# EAGLE schematic GameBit_Board (EAGLE 9.0.1)

## Sheet 1 of 3
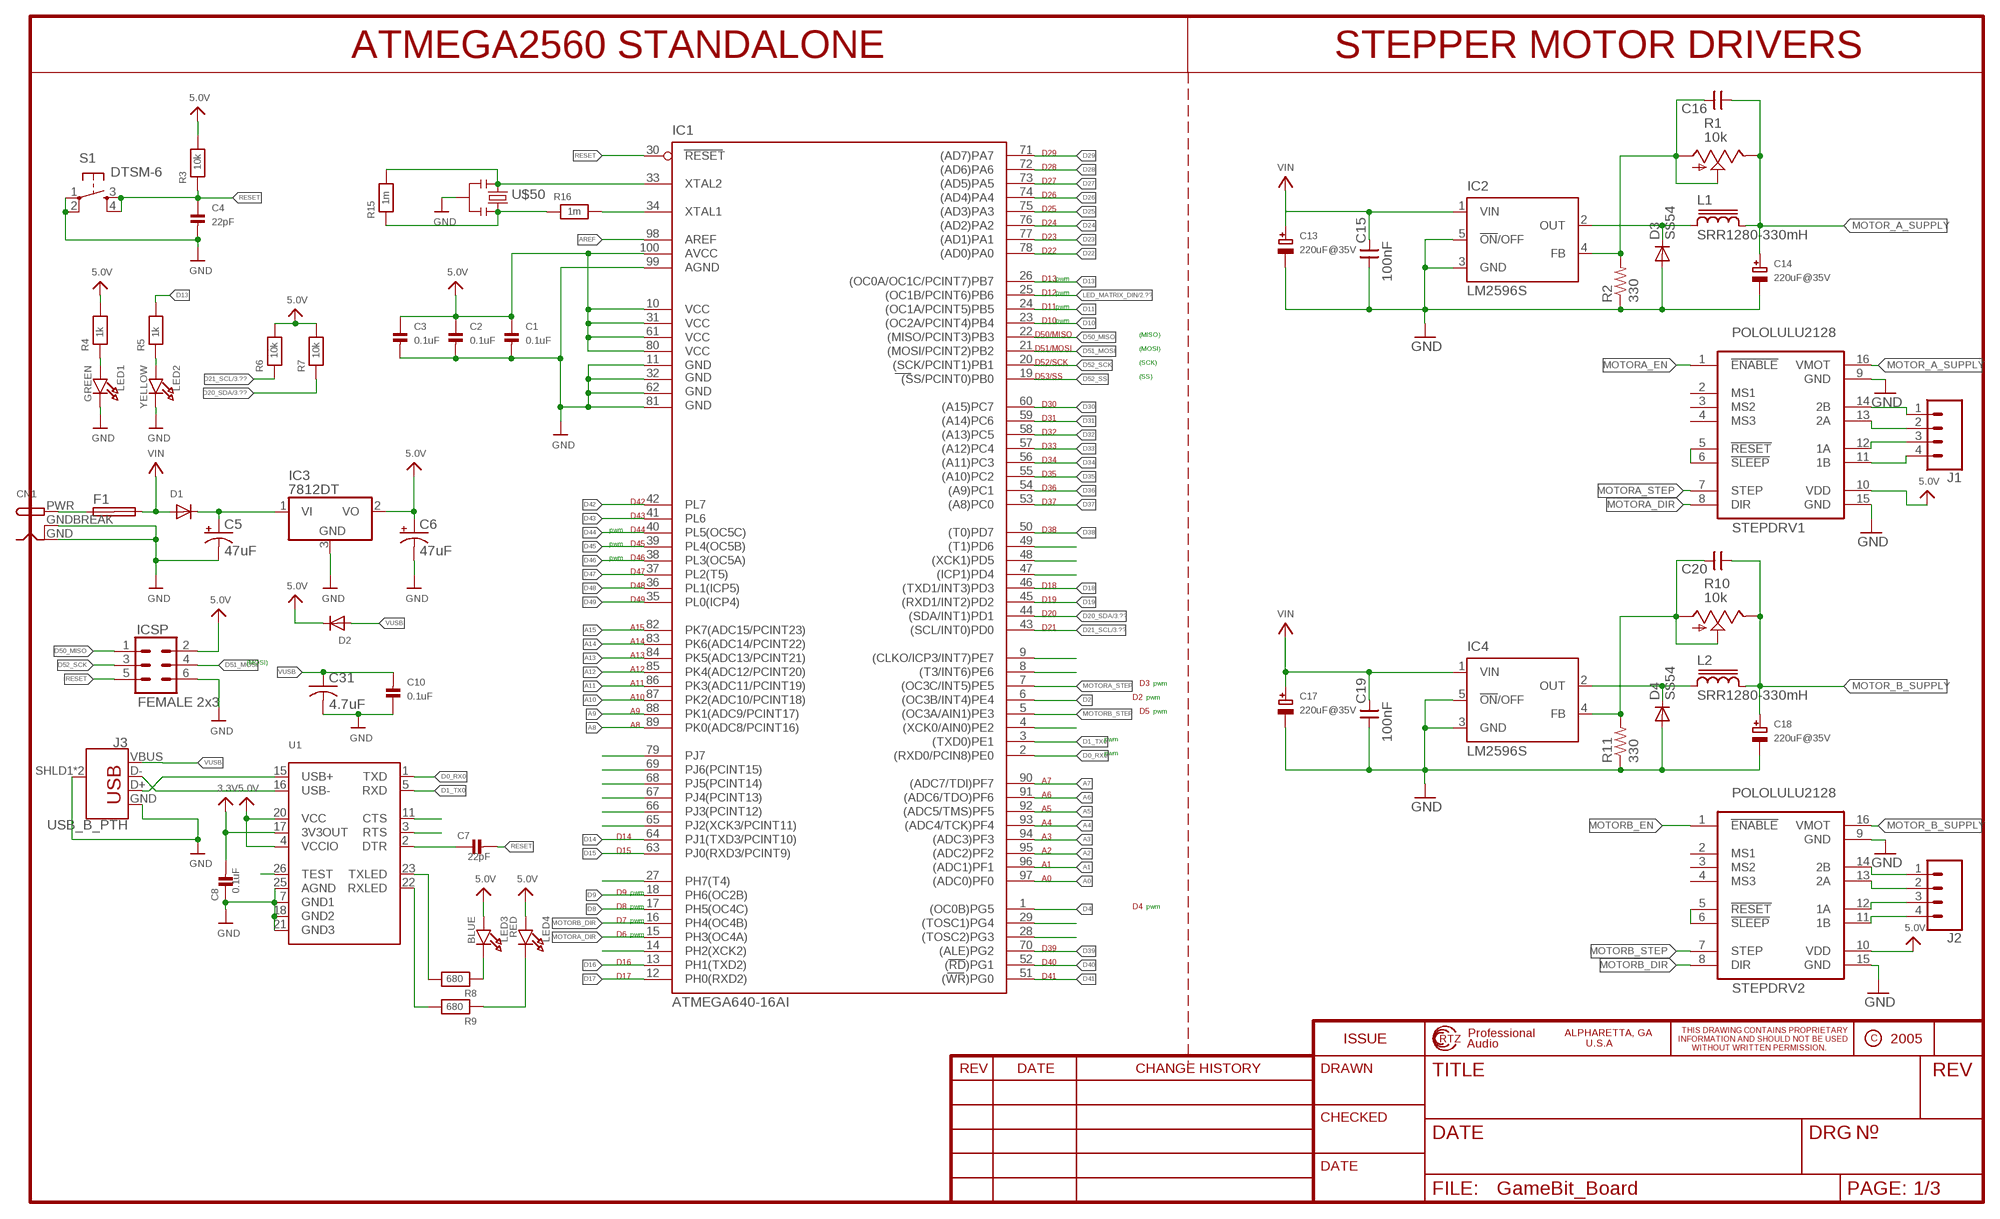
[diagram p0: schematic, sheet 1]

### Parts
C1  0.1uF  CAP_CERAMIC0603  [0603]
C2  0.1uF  CAP_CERAMIC0603  [0603]
C3  0.1uF  CAP_CERAMIC0603  [0603]
C4  22pF  CAP_CERAMIC0603  [0603]
C5  47uF  CPOL-USD  [PANASONIC_D]
C6  47uF  CPOL-USD  [PANASONIC_D]
C7  22pF  CAP_CERAMIC0603  [0603]
C8  0.1uF  CAP_CERAMIC0603  [0603]
C10  0.1uF  CAP_CERAMIC0603  [0603]
C13  220uF@35V  CAP_ELECTROLYTICPANASONIC_D  [PANASONIC_D]
C14  220uF@35V  CAP_ELECTROLYTICPANASONIC_D  [PANASONIC_D]
C15  100nF  CNP-0603  [0603]
C16  CNP-0603  [0603]
C17  220uF@35V  CAP_ELECTROLYTICPANASONIC_D  [PANASONIC_D]
C18  220uF@35V  CAP_ELECTROLYTICPANASONIC_D  [PANASONIC_D]
C19  100nF  CNP-0603  [0603]
C20  CNP-0603  [0603]
C31  4.7uF  C-USC0805  [C0805]
CN1  DCBARRELPTH  [DCJACK_2MM_PTH]
D1  DIODESOD-123  [SOD-123]
D2  DIODESOD-123  [SOD-123]
D3  SS54  S3G  [DO214AB]
D4  SS54  S3G  [DO214AB]
F1  SHK20L  [SHK20L]
IC1  ATMEGA640-16AI  [TQFP100]
IC2  LM2596S  [TO263-5]
IC3  7812DT  [TO252]
IC4  LM2596S  [TO263-5]
ICSP  FEMALE 2x3  CONN_03X2FEMALE  [2X3]
J1  CONN_04JST-PTH-VERT  [JST-4-PTH-VERT]
J2  CONN_04JST-PTH-VERT  [JST-4-PTH-VERT]
J3  USB_B_PTH  [USB-B-PTH]
L1  SRR1280-330mH  SRR1280  [SRR1280]
L2  SRR1280-330mH  SRR1280  [SRR1280]
LED1  GREEN  LED0603  [CHIPLED_0603]
LED2  YELLOW  LED0603  [CHIPLED_0603]
LED3  BLUE  LED0603  [CHIPLED_0603]
LED4  RED  LED0603  [CHIPLED_0603]
R1  10k  TRIM_US-S64W  [S64W]
R2  330  R-US_R0603  [R0603]
R3  10k  RESISTOR0603  [0603]
R4  1k  RESISTOR0603  [0603]
R5  1k  RESISTOR0603  [0603]
R6  10k  RESISTOR0603  [0603]
R7  10k  RESISTOR0603  [0603]
R8  680  RESISTOR0603  [0603]
R9  680  RESISTOR0603  [0603]
R10  10k  TRIM_US-S64W  [S64W]
R11  330  R-US_R0603  [R0603]
R15  1m  RESISTOR0805  [0805]
R16  1m  RESISTOR0805  [0805]
S1  DTSM-6  [DTSM-6]
STEPDRV1  POLOLULU2128  [POLOLULU2128]
STEPDRV2  POLOLULU2128  [POLOLULU2128]
U1  FT232RLSSOP28  [SSOP28DB]
U$50  RESONATORSMD  [RESONATOR-SMD]

### Nets
3.3V: C8.2 U1.17(3V3OUT)
5.0V: C1.1 C2.1 C3.1 C6.+ D2.C IC1.10(VCC) IC1.31(VCC1) IC1.61(VCC2) IC1.80(VCC3) IC1.100(AVCC) IC3.2(VO) ICSP.2 LED3.A LED4.A R3.2 R4.2 R6.2 R7.2 STEPDRV1.10(VDD) STEPDRV2.10(VDD) U1.4(VCCIO) U1.20(VCC) ; also sheet 3
A0: IC1.97((ADC0)PF0)
A1: IC1.96((ADC1)PF1)
A2: IC1.95((ADC2)PF2)
A3: IC1.94((ADC3)PF3)
A4: IC1.93((ADC4/TCK)PF4)
A5: IC1.92((ADC5/TMS)PF5)
A6: IC1.91((ADC6/TDO)PF6)
A7: IC1.90((ADC7/TDI)PF7)
A8: IC1.89(PK0(ADC8/PCINT16))
A9: IC1.88(PK1(ADC9/PCINT17))
A10: IC1.87(PK2(ADC10/PCINT18))
A11: IC1.86(PK3(ADC11/PCINT19))
A12: IC1.85(PK4(ADC12/PCINT20))
A13: IC1.84(PK5(ADC13/PCINT21))
A14: IC1.83(PK6(ADC14/PCINT22))
A15: IC1.82(PK7(ADC15/PCINT23))
AREF: IC1.98(AREF)
D0_RX0: IC1.2((RXD0/PCIN8)PE0) U1.1(TXD)
D1_TX0: IC1.3((TXD0)PE1) U1.5(RXD)
D2: IC1.6((OC3B/INT4)PE4)
D4: IC1.1((OC0B)PG5)
D8: IC1.17(PH5(OC4C))
D9: IC1.18(PH6(OC2B))
D10: IC1.23((OC2A/PCINT4)PB4)
D11: IC1.24((OC1A/PCINT5)PB5)
D13: IC1.26((OC0A/OC1C/PCINT7)PB7) R5.2
D14: IC1.64(PJ1(TXD3/PCINT10))
D15: IC1.63(PJ0(RXD3/PCINT9))
D16: IC1.13(PH1(TXD2))
D17: IC1.12(PH0(RXD2))
D18: IC1.46((TXD1/INT3)PD3)
D19: IC1.45((RXD1/INT2)PD2)
D20_SDA: IC1.44((SDA/INT1)PD1) R7.1 ; also sheet 3
D21_SCL: IC1.43((SCL/INT0)PD0) R6.1 ; also sheet 3
D22: IC1.78((AD0)PA0)
D23: IC1.77((AD1)PA1)
D24: IC1.76((AD2)PA2)
D25: IC1.75((AD3)PA3)
D26: IC1.74((AD4)PA4)
D27: IC1.73((AD5)PA5)
D28: IC1.72((AD6)PA6)
D29: IC1.71((AD7)PA7)
D30: IC1.60((A15)PC7)
D31: IC1.59((A14)PC6)
D32: IC1.58((A13)PC5)
D33: IC1.57((A12)PC4)
D34: IC1.56((A11)PC3)
D35: IC1.55((A10)PC2)
D36: IC1.54((A9)PC1)
D37: IC1.53((A8)PC0)
D38: IC1.50((T0)PD7)
D39: IC1.70((ALE)PG2)
D40: IC1.52((RD)PG1)
D41: IC1.51((WR)PG0)
D42: IC1.42(PL7)
D43: IC1.41(PL6)
D44: IC1.40(PL5(OC5C))
D45: IC1.39(PL4(OC5B))
D46: IC1.38(PL3(OC5A))
D47: IC1.37(PL2(T5))
D48: IC1.36(PL1(ICP5))
D49: IC1.35(PL0(ICP4))
D50_MISO: IC1.22((MISO/PCINT3)PB3) ICSP.1
D51_MOSI: IC1.21((MOSI/PCINT2)PB2) ICSP.4
D52_SCK: IC1.20((SCK/PCINT1)PB1) ICSP.3
D52_SS: IC1.19((SS/PCINT0)PB0)
GND: C1.2 C2.2 C3.2 C4.2 C5.- C6.- C8.1 C10.1 C13.- C14.- C15.1 C17.- C18.- C19.1 C31.2 CN1.GND CN1.GNDBREAK D3.A D4.A IC1.11(GND) IC1.32(GND1) IC1.62(GND2) IC1.81(GND3) IC1.99(AGND) IC2.3(GND) IC2.5(!ON!/OFF) IC3.3(GND) IC4.3(GND) IC4.5(!ON!/OFF) ICSP.6 J3.GND J3.SHLD1(SHIELD) J3.SHLD2(SHIELD) LED1.C LED2.C R2.1 R11.1 S1.1 S1.2 STEPDRV1.9(GND) STEPDRV1.15(GND) STEPDRV2.9(GND) STEPDRV2.15(GND) U1.7(GND1) U1.18(GND2) U1.21(GND3) U1.25(AGND) U$50.2 ; also sheet 2,3
LED_MATRIX_DIN: IC1.25((OC1B/PCINT6)PB6) ; also sheet 2
MOTOR_A_SUPPLY: C14.+ C16.1 L1.2 R1.E STEPDRV1.16(VMOT)
MOTOR_B_SUPPLY: C18.+ C20.1 L2.2 R10.E STEPDRV2.16(VMOT)
MOTORA_DIR: IC1.15(PH3(OC4A)) STEPDRV1.8(DIR)
MOTORA_EN: STEPDRV1.1(!ENABLE)
MOTORA_STEP: IC1.7((OC3C/INT5)PE5) STEPDRV1.7(STEP)
MOTORB_DIR: IC1.16(PH4(OC4B)) STEPDRV2.8(DIR)
MOTORB_EN: STEPDRV2.1(!ENABLE)
MOTORB_STEP: IC1.5((OC3A/AIN1)PE3) STEPDRV2.7(STEP)
N$1: IC1.65(PJ2(XCK3/PCINT11))
N$2: IC1.66(PJ3(PCINT12))
N$3: D3.C IC2.2(OUT) L1.1
N$4: IC1.67(PJ4(PCINT13))
N$5: IC1.68(PJ5(PCINT14))
N$6: IC1.69(PJ6(PCINT15))
N$7: IC1.79(PJ7)
N$8: IC1.27(PH7(T4))
N$9: IC1.9((CLKO/ICP3/INT7)PE7)
N$10: IC1.49((T1)PD6)
N$11: IC1.48((XCK1)PD5)
N$12: IC1.47((ICP1)PD4)
N$13: IC1.14(PH2(XCK2))
N$14: IC1.8((T3/INT6)PE6)
N$15: CN1.PWR F1.1A
N$16: J3.D+ U1.15(USB+)
N$17: J3.D- U1.16(USB-)
N$18: IC1.4((XCK0/AIN0)PE2)
N$19: LED1.A R4.1
N$20: LED2.A R5.1
N$21: LED3.C R8.1
N$22: R9.2 U1.22(RXLED)
N$23: R8.2 U1.23(TXLED)
N$24: LED4.C R9.1
N$25: IC1.29((TOSC1)PG4)
N$26: IC1.28((TOSC2)PG3)
N$27: C16.2 IC2.4(FB) R1.A R1.S R2.2
N$28: U1.26(TEST)
N$29: U1.11(CTS)
N$30: U1.3(RTS)
N$31: C7.1 U1.2(DTR)
N$32: D4.C IC4.2(OUT) L2.1
N$33: C20.2 IC4.4(FB) R10.A R10.S R11.2
N$34: J1.1 STEPDRV1.14(2B)
N$35: J1.2 STEPDRV1.13(2A)
N$36: J1.3 STEPDRV1.12(1A)
N$37: J1.4 STEPDRV1.11(1B)
N$38: J2.1 STEPDRV2.14(2B)
N$39: J2.2 STEPDRV2.13(2A)
N$40: J2.3 STEPDRV2.12(1A)
N$41: J2.4 STEPDRV2.11(1B)
N$42: STEPDRV1.5(!RESET) STEPDRV1.6(!SLEEP)
N$44: STEPDRV2.5(!RESET) STEPDRV2.6(!SLEEP)
N$77: R15.1 R16.1 U$50.3
N$85: IC1.34(XTAL1) R16.2
N$93: C5.+ D1.C IC3.1(VI)
RESET: C4.1 C7.2 IC1.30(RESET) ICSP.5 R3.1 S1.3 S1.4
VIN: C13.+ C15.2 C17.+ C19.2 D1.A F1.2A IC2.1(VIN) IC4.1(VIN) ; also sheet 2
VUSB: C10.2 C31.1 D2.A J3.VBUS
XTAL2: IC1.33(XTAL2) R15.2 U$50.1
Unconnected: F1.1B F1.2B STEPDRV1.2(MS1) STEPDRV1.3(MS2) STEPDRV1.4(MS3) STEPDRV2.2(MS1) STEPDRV2.3(MS2) STEPDRV2.4(MS3)

### Notes on the sheet
- ATMEGA2560 STANDALONE | STEPPER MOTOR DRIVERS
- D29
- D28
- D27
- D26
- D25
- D24
- D23
- D22
- D13 | pwm
- D12 | pwm
- D11 | pwm
- D10 | pwm
- D50/MISO | (MISO)
- D51/MOSI | (MOSI)
- D52/SCK | (SCK)
- D53/SS | (SS)
- D30
- D31
- D32
- D33
- D34
- D35
- D36
- D42 | D37
- D43
- pwm | D44 | D38
- pwm | D45
- pwm | D46
- D47
- D48 | D18
- D49 | D19
- D20
- A15 | D21
- A14
- A13
- (MOSI)
- A12
- A11 | D3 | pwm
- A10 | D2 | pwm
- A9 | D5 | pwm
- A8
- pwm
- pwm
- A7
- A6
- A5
- A4
- D14 | A3
- D15 | A2
- A1
- A0
- D9 | pwm
- D8 | pwm | D4 | pwm
- D7 | pwm
- D6 | pwm
- D39
- D16 | D40
- D17 | D41

## Sheet 2 of 3
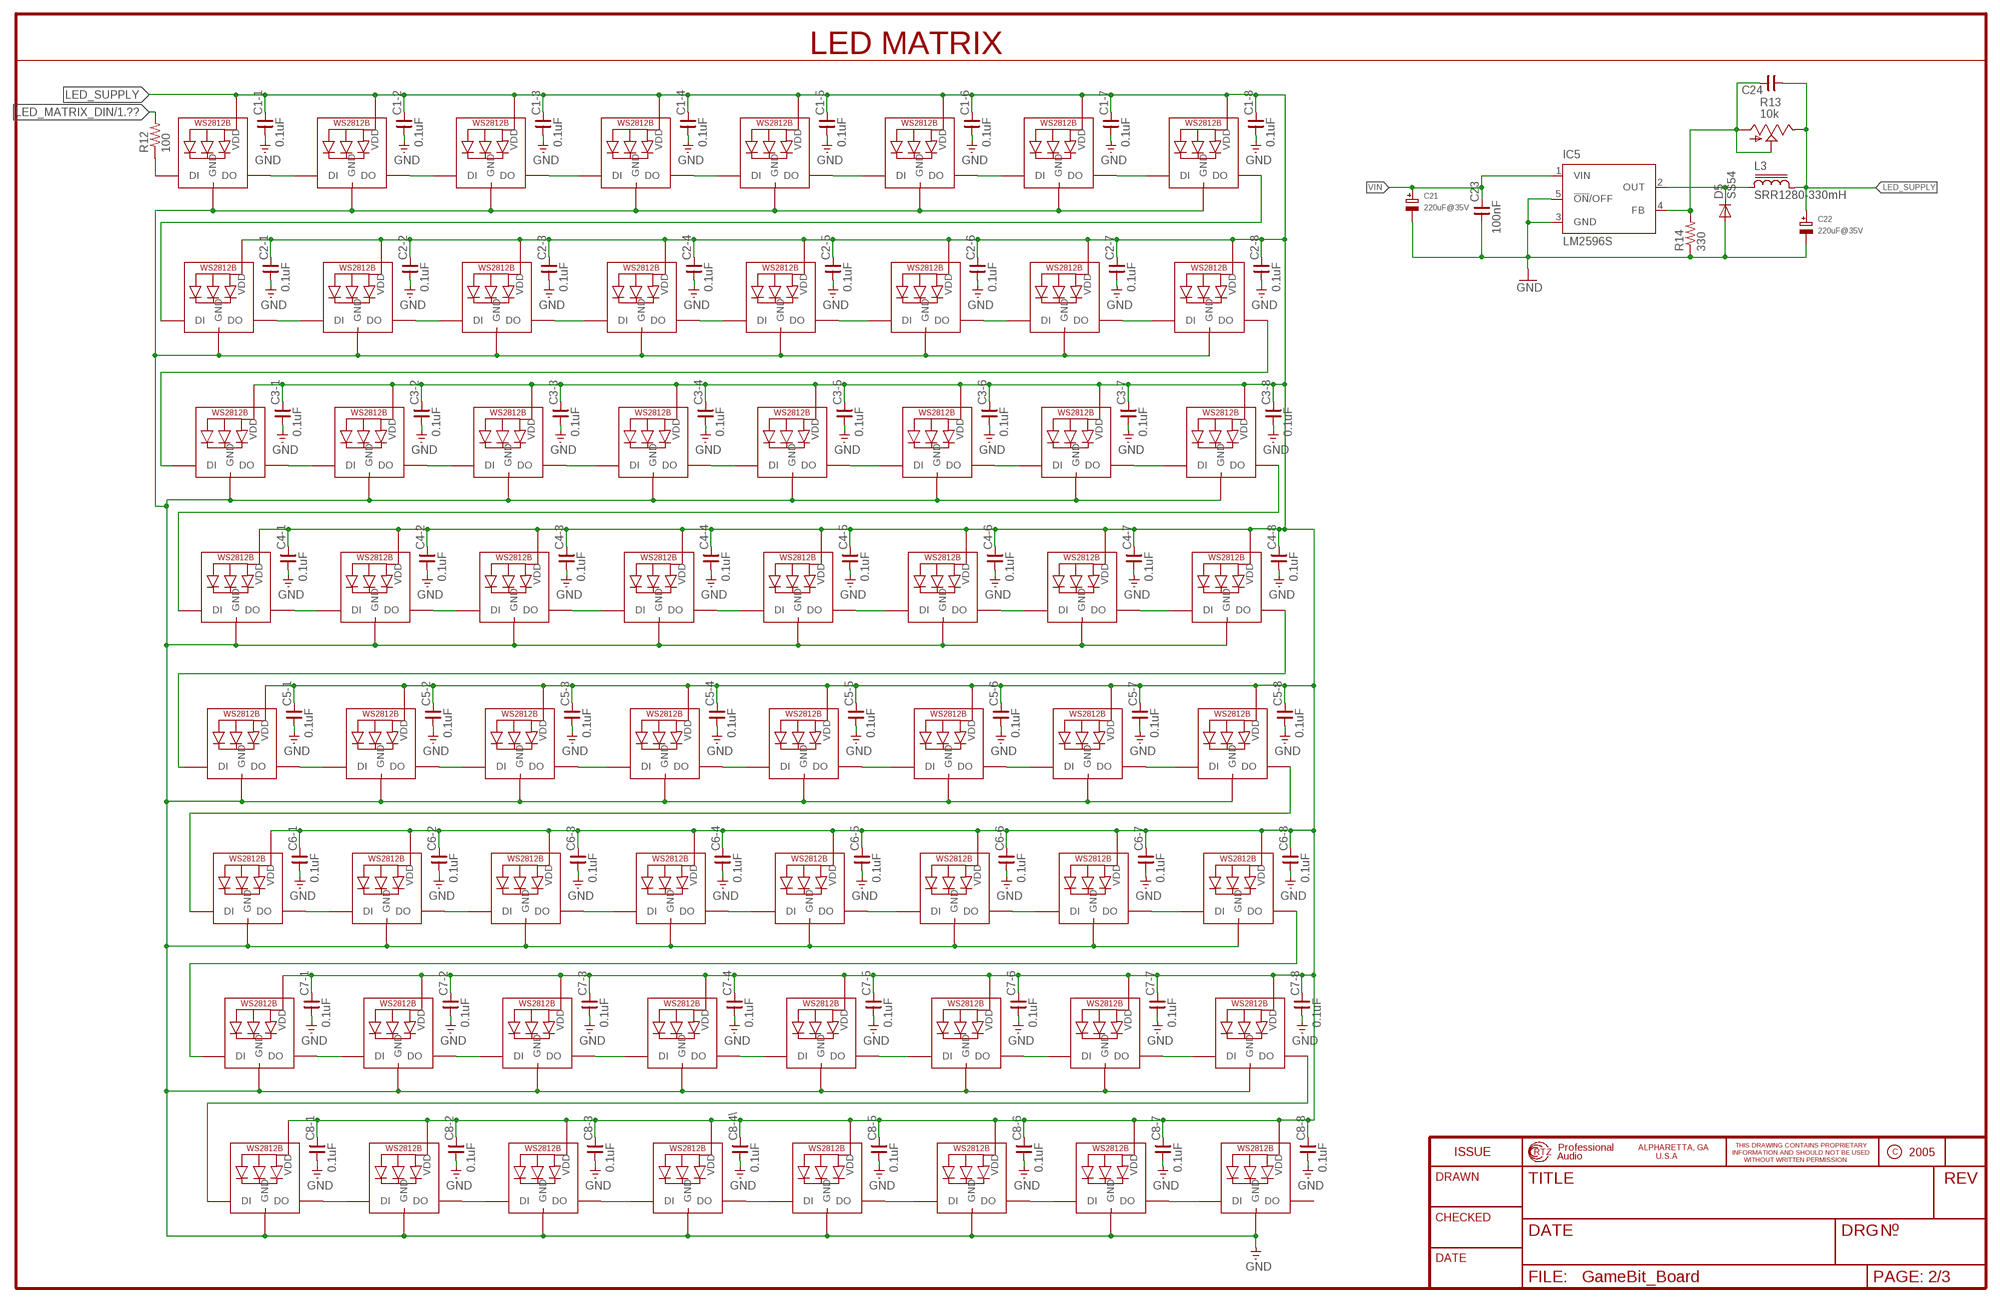
[diagram p1: schematic, sheet 2]

### Parts
C1-1  0.1uF  CNP-0805  [0805]
C1-2  0.1uF  CNP-0805  [0805]
C1-3  0.1uF  CNP-0805  [0805]
C1-4  0.1uF  CNP-0805  [0805]
C1-5  0.1uF  CNP-0805  [0805]
C1-6  0.1uF  CNP-0805  [0805]
C1-7  0.1uF  CNP-0805  [0805]
C1-8  0.1uF  CNP-0805  [0805]
C2-1  0.1uF  CNP-0805  [0805]
C2-2  0.1uF  CNP-0805  [0805]
C2-3  0.1uF  CNP-0805  [0805]
C2-4  0.1uF  CNP-0805  [0805]
C2-5  0.1uF  CNP-0805  [0805]
C2-6  0.1uF  CNP-0805  [0805]
C2-7  0.1uF  CNP-0805  [0805]
C2-8  0.1uF  CNP-0805  [0805]
C3-1  0.1uF  CNP-0805  [0805]
C3-2  0.1uF  CNP-0805  [0805]
C3-3  0.1uF  CNP-0805  [0805]
C3-4  0.1uF  CNP-0805  [0805]
C3-5  0.1uF  CNP-0805  [0805]
C3-6  0.1uF  CNP-0805  [0805]
C3-7  0.1uF  CNP-0805  [0805]
C3-8  0.1uF  CNP-0805  [0805]
C4-1  0.1uF  CNP-0805  [0805]
C4-2  0.1uF  CNP-0805  [0805]
C4-3  0.1uF  CNP-0805  [0805]
C4-4  0.1uF  CNP-0805  [0805]
C4-5  0.1uF  CNP-0805  [0805]
C4-6  0.1uF  CNP-0805  [0805]
C4-7  0.1uF  CNP-0805  [0805]
C4-8  0.1uF  CNP-0805  [0805]
C5-1  0.1uF  CNP-0805  [0805]
C5-2  0.1uF  CNP-0805  [0805]
C5-3  0.1uF  CNP-0805  [0805]
C5-4  0.1uF  CNP-0805  [0805]
C5-5  0.1uF  CNP-0805  [0805]
C5-6  0.1uF  CNP-0805  [0805]
C5-7  0.1uF  CNP-0805  [0805]
C5-8  0.1uF  CNP-0805  [0805]
C6-1  0.1uF  CNP-0805  [0805]
C6-2  0.1uF  CNP-0805  [0805]
C6-3  0.1uF  CNP-0805  [0805]
C6-4  0.1uF  CNP-0805  [0805]
C6-5  0.1uF  CNP-0805  [0805]
C6-6  0.1uF  CNP-0805  [0805]
C6-7  0.1uF  CNP-0805  [0805]
C6-8  0.1uF  CNP-0805  [0805]
C7-1  0.1uF  CNP-0805  [0805]
C7-2  0.1uF  CNP-0805  [0805]
C7-3  0.1uF  CNP-0805  [0805]
C7-4  0.1uF  CNP-0805  [0805]
C7-5  0.1uF  CNP-0805  [0805]
C7-6  0.1uF  CNP-0805  [0805]
C7-7  0.1uF  CNP-0805  [0805]
C7-8  0.1uF  CNP-0805  [0805]
C8-1  0.1uF  CNP-0805  [0805]
C8-2  0.1uF  CNP-0805  [0805]
C8-3  0.1uF  CNP-0805  [0805]
C8-4\  0.1uF  CNP-0805  [0805]
C8-5  0.1uF  CNP-0805  [0805]
C8-6  0.1uF  CNP-0805  [0805]
C8-7  0.1uF  CNP-0805  [0805]
C8-8  0.1uF  CNP-0805  [0805]
C21  220uF@35V  CAP_ELECTROLYTICPANASONIC_D  [PANASONIC_D]
C22  220uF@35V  CAP_ELECTROLYTICPANASONIC_D  [PANASONIC_D]
C23  100nF  CNP-0603  [0603]
C24  CNP-0603  [0603]
D5  SS54  S3G  [DO214AB]
IC5  LM2596S  [TO263-5]
L3  SRR1280-330mH  SRR1280  [SRR1280]
LED1-1  WS2812B5050  [WS2812B]
LED1-2  WS2812B5050  [WS2812B]
LED1-3  WS2812B5050  [WS2812B]
LED1-4  WS2812B5050  [WS2812B]
LED1-5  WS2812B5050  [WS2812B]
LED1-6  WS2812B5050  [WS2812B]
LED1-7  WS2812B5050  [WS2812B]
LED1-8  WS2812B5050  [WS2812B]
LED2-1  WS2812B5050  [WS2812B]
LED2-2  WS2812B5050  [WS2812B]
LED2-3  WS2812B5050  [WS2812B]
LED2-4  WS2812B5050  [WS2812B]
LED2-5  WS2812B5050  [WS2812B]
LED2-6  WS2812B5050  [WS2812B]
LED2-7  WS2812B5050  [WS2812B]
LED2-8  WS2812B5050  [WS2812B]
LED3-1  WS2812B5050  [WS2812B]
LED3-2  WS2812B5050  [WS2812B]
LED3-3  WS2812B5050  [WS2812B]
LED3-4  WS2812B5050  [WS2812B]
LED3-5  WS2812B5050  [WS2812B]
LED3-6  WS2812B5050  [WS2812B]
LED3-7  WS2812B5050  [WS2812B]
LED3-8  WS2812B5050  [WS2812B]
LED4-1  WS2812B5050  [WS2812B]
LED4-2  WS2812B5050  [WS2812B]
LED4-3  WS2812B5050  [WS2812B]
LED4-4  WS2812B5050  [WS2812B]
LED4-5  WS2812B5050  [WS2812B]
LED4-6  WS2812B5050  [WS2812B]
LED4-7  WS2812B5050  [WS2812B]
LED4-8  WS2812B5050  [WS2812B]
LED5-1  WS2812B5050  [WS2812B]
LED5-2  WS2812B5050  [WS2812B]
LED5-3  WS2812B5050  [WS2812B]
LED5-4  WS2812B5050  [WS2812B]
LED5-5  WS2812B5050  [WS2812B]
LED5-6  WS2812B5050  [WS2812B]
LED5-7  WS2812B5050  [WS2812B]
LED5-8  WS2812B5050  [WS2812B]
LED6-1  WS2812B5050  [WS2812B]
LED6-2  WS2812B5050  [WS2812B]
LED6-3  WS2812B5050  [WS2812B]
LED6-4  WS2812B5050  [WS2812B]
LED6-5  WS2812B5050  [WS2812B]
LED6-6  WS2812B5050  [WS2812B]
LED6-7  WS2812B5050  [WS2812B]
LED6-8  WS2812B5050  [WS2812B]
LED7-1  WS2812B5050  [WS2812B]
LED7-2  WS2812B5050  [WS2812B]
LED7-3  WS2812B5050  [WS2812B]
LED7-4  WS2812B5050  [WS2812B]
LED7-5  WS2812B5050  [WS2812B]
LED7-6  WS2812B5050  [WS2812B]
LED7-7  WS2812B5050  [WS2812B]
LED7-8  WS2812B5050  [WS2812B]
LED8-1  WS2812B5050  [WS2812B]
LED8-2  WS2812B5050  [WS2812B]
LED8-3  WS2812B5050  [WS2812B]
LED8-4  WS2812B5050  [WS2812B]
LED8-5  WS2812B5050  [WS2812B]
LED8-6  WS2812B5050  [WS2812B]
LED8-7  WS2812B5050  [WS2812B]
LED8-8  WS2812B5050  [WS2812B]
R12  100  R-US_R0805  [R0805]
R13  10k  TRIM_US-S64W  [S64W]
R14  330  R-US_R0603  [R0603]

### Nets
GND: C1-1.1 C1-2.1 C1-3.1 C1-4.1 C1-5.1 C1-6.1 C1-7.1 C1-8.1 C2-1.1 C2-2.1 C2-3.1 C2-4.1 C2-5.1 C2-6.1 C2-7.1 C2-8.1 C3-1.1 C3-2.1 C3-3.1 C3-4.1 C3-5.1 C3-6.1 C3-7.1 C3-8.1 C4-1.1 C4-2.1 C4-3.1 C4-4.1 C4-5.1 C4-6.1 C4-7.1 C4-8.1 C5-1.1 C5-2.1 C5-3.1 C5-4.1 C5-5.1 C5-6.1 C5-7.1 C5-8.1 C6-1.1 C6-2.1 C6-3.1 C6-4.1 C6-5.1 C6-6.1 C6-7.1 C6-8.1 C7-1.1 C7-2.1 C7-3.1 C7-4.1 C7-5.1 C7-6.1 C7-7.1 C7-8.1 C8-1.1 C8-2.1 C8-3.1 C8-4\.1 C8-5.1 C8-6.1 C8-7.1 C8-8.1 C21.- C22.- C23.1 D5.A IC5.3(GND) IC5.5(!ON!/OFF) LED1-1.3-GND(GND) LED1-2.3-GND(GND) LED1-3.3-GND(GND) LED1-4.3-GND(GND) LED1-5.3-GND(GND) LED1-6.3-GND(GND) LED1-7.3-GND(GND) LED1-8.3-GND(GND) LED2-1.3-GND(GND) LED2-2.3-GND(GND) LED2-3.3-GND(GND) LED2-4.3-GND(GND) LED2-5.3-GND(GND) LED2-6.3-GND(GND) LED2-7.3-GND(GND) LED2-8.3-GND(GND) LED3-1.3-GND(GND) LED3-2.3-GND(GND) LED3-3.3-GND(GND) LED3-4.3-GND(GND) LED3-5.3-GND(GND) LED3-6.3-GND(GND) LED3-7.3-GND(GND) LED3-8.3-GND(GND) LED4-1.3-GND(GND) LED4-2.3-GND(GND) LED4-3.3-GND(GND) LED4-4.3-GND(GND) LED4-5.3-GND(GND) LED4-6.3-GND(GND) LED4-7.3-GND(GND) LED4-8.3-GND(GND) LED5-1.3-GND(GND) LED5-2.3-GND(GND) LED5-3.3-GND(GND) LED5-4.3-GND(GND) LED5-5.3-GND(GND) LED5-6.3-GND(GND) LED5-7.3-GND(GND) LED5-8.3-GND(GND) LED6-1.3-GND(GND) LED6-2.3-GND(GND) LED6-3.3-GND(GND) LED6-4.3-GND(GND) LED6-5.3-GND(GND) LED6-6.3-GND(GND) LED6-7.3-GND(GND) LED6-8.3-GND(GND) LED7-1.3-GND(GND) LED7-2.3-GND(GND) LED7-3.3-GND(GND) LED7-4.3-GND(GND) LED7-5.3-GND(GND) LED7-6.3-GND(GND) LED7-7.3-GND(GND) LED7-8.3-GND(GND) LED8-1.3-GND(GND) LED8-2.3-GND(GND) LED8-3.3-GND(GND) LED8-4.3-GND(GND) LED8-5.3-GND(GND) LED8-6.3-GND(GND) LED8-7.3-GND(GND) LED8-8.3-GND(GND) R14.1 ; also sheet 1,3
LED_MATRIX_DIN: R12.2 ; also sheet 1
LED_SUPPLY: C1-1.2 C1-2.2 C1-3.2 C1-4.2 C1-5.2 C1-6.2 C1-7.2 C1-8.2 C2-1.2 C2-2.2 C2-3.2 C2-4.2 C2-5.2 C2-6.2 C2-7.2 C2-8.2 C3-1.2 C3-2.2 C3-3.2 C3-4.2 C3-5.2 C3-6.2 C3-7.2 C3-8.2 C4-1.2 C4-2.2 C4-3.2 C4-4.2 C4-5.2 C4-6.2 C4-7.2 C4-8.2 C5-1.2 C5-2.2 C5-3.2 C5-4.2 C5-5.2 C5-6.2 C5-7.2 C5-8.2 C6-1.2 C6-2.2 C6-3.2 C6-4.2 C6-5.2 C6-6.2 C6-7.2 C6-8.2 C7-1.2 C7-2.2 C7-3.2 C7-4.2 C7-5.2 C7-6.2 C7-7.2 C7-8.2 C8-1.2 C8-2.2 C8-3.2 C8-4\.2 C8-5.2 C8-6.2 C8-7.2 C8-8.2 C22.+ C24.1 L3.2 LED1-1.1-VDD(VDD) LED1-2.1-VDD(VDD) LED1-3.1-VDD(VDD) LED1-4.1-VDD(VDD) LED1-5.1-VDD(VDD) LED1-6.1-VDD(VDD) LED1-7.1-VDD(VDD) LED1-8.1-VDD(VDD) LED2-1.1-VDD(VDD) LED2-2.1-VDD(VDD) LED2-3.1-VDD(VDD) LED2-4.1-VDD(VDD) LED2-5.1-VDD(VDD) LED2-6.1-VDD(VDD) LED2-7.1-VDD(VDD) LED2-8.1-VDD(VDD) LED3-1.1-VDD(VDD) LED3-2.1-VDD(VDD) LED3-3.1-VDD(VDD) LED3-4.1-VDD(VDD) LED3-5.1-VDD(VDD) LED3-6.1-VDD(VDD) LED3-7.1-VDD(VDD) LED3-8.1-VDD(VDD) LED4-1.1-VDD(VDD) LED4-2.1-VDD(VDD) LED4-3.1-VDD(VDD) LED4-4.1-VDD(VDD) LED4-5.1-VDD(VDD) LED4-6.1-VDD(VDD) LED4-7.1-VDD(VDD) LED4-8.1-VDD(VDD) LED5-1.1-VDD(VDD) LED5-2.1-VDD(VDD) LED5-3.1-VDD(VDD) LED5-4.1-VDD(VDD) LED5-5.1-VDD(VDD) LED5-6.1-VDD(VDD) LED5-7.1-VDD(VDD) LED5-8.1-VDD(VDD) LED6-1.1-VDD(VDD) LED6-2.1-VDD(VDD) LED6-3.1-VDD(VDD) LED6-4.1-VDD(VDD) LED6-5.1-VDD(VDD) LED6-6.1-VDD(VDD) LED6-7.1-VDD(VDD) LED6-8.1-VDD(VDD) LED7-1.1-VDD(VDD) LED7-2.1-VDD(VDD) LED7-3.1-VDD(VDD) LED7-4.1-VDD(VDD) LED7-5.1-VDD(VDD) LED7-6.1-VDD(VDD) LED7-7.1-VDD(VDD) LED7-8.1-VDD(VDD) LED8-1.1-VDD(VDD) LED8-2.1-VDD(VDD) LED8-3.1-VDD(VDD) LED8-4.1-VDD(VDD) LED8-5.1-VDD(VDD) LED8-6.1-VDD(VDD) LED8-7.1-VDD(VDD) LED8-8.1-VDD(VDD) R13.E
LED_SUPPLY1: LED1-8.2-DOUT(DO) LED2-1.4-DIN(DI)
LED_SUPPLY3: LED3-8.2-DOUT(DO) LED4-1.4-DIN(DI)
LED_SUPPLY4: LED5-8.2-DOUT(DO) LED6-1.4-DIN(DI)
LED_SUPPLY5: LED7-8.2-DOUT(DO) LED8-1.4-DIN(DI)
N$43: LED1-1.4-DIN(DI) R12.1
N$45: LED1-1.2-DOUT(DO) LED1-2.4-DIN(DI)
N$46: LED1-2.2-DOUT(DO) LED1-3.4-DIN(DI)
N$47: LED1-3.2-DOUT(DO) LED1-4.4-DIN(DI)
N$48: LED1-4.2-DOUT(DO) LED1-5.4-DIN(DI)
N$49: LED1-5.2-DOUT(DO) LED1-6.4-DIN(DI)
N$50: LED1-6.2-DOUT(DO) LED1-7.4-DIN(DI)
N$51: LED1-7.2-DOUT(DO) LED1-8.4-DIN(DI)
N$52: D5.C IC5.2(OUT) L3.1
N$53: LED2-1.2-DOUT(DO) LED2-2.4-DIN(DI)
N$54: LED2-2.2-DOUT(DO) LED2-3.4-DIN(DI)
N$55: LED2-3.2-DOUT(DO) LED2-4.4-DIN(DI)
N$56: LED2-4.2-DOUT(DO) LED2-5.4-DIN(DI)
N$57: LED2-5.2-DOUT(DO) LED2-6.4-DIN(DI)
N$58: LED2-6.2-DOUT(DO) LED2-7.4-DIN(DI)
N$59: LED2-7.2-DOUT(DO) LED2-8.4-DIN(DI)
N$60: C24.2 IC5.4(FB) R13.A R13.S R14.2
N$61: LED5-1.2-DOUT(DO) LED5-2.4-DIN(DI)
N$62: LED3-1.2-DOUT(DO) LED3-2.4-DIN(DI)
N$63: LED3-2.2-DOUT(DO) LED3-3.4-DIN(DI)
N$64: LED3-3.2-DOUT(DO) LED3-4.4-DIN(DI)
N$65: LED3-4.2-DOUT(DO) LED3-5.4-DIN(DI)
N$66: LED3-5.2-DOUT(DO) LED3-6.4-DIN(DI)
N$67: LED3-6.2-DOUT(DO) LED3-7.4-DIN(DI)
N$68: LED3-7.2-DOUT(DO) LED3-8.4-DIN(DI)
N$69: LED6-6.2-DOUT(DO) LED6-7.4-DIN(DI)
N$70: LED4-1.2-DOUT(DO) LED4-2.4-DIN(DI)
N$71: LED4-2.2-DOUT(DO) LED4-3.4-DIN(DI)
N$72: LED4-3.2-DOUT(DO) LED4-4.4-DIN(DI)
N$73: LED4-4.2-DOUT(DO) LED4-5.4-DIN(DI)
N$74: LED4-5.2-DOUT(DO) LED4-6.4-DIN(DI)
N$75: LED4-6.2-DOUT(DO) LED4-7.4-DIN(DI)
N$76: LED4-7.2-DOUT(DO) LED4-8.4-DIN(DI)
N$78: LED5-2.2-DOUT(DO) LED5-3.4-DIN(DI)
N$79: LED2-8.2-DOUT(DO) LED3-1.4-DIN(DI)
N$80: LED5-3.2-DOUT(DO) LED5-4.4-DIN(DI)
N$81: LED5-4.2-DOUT(DO) LED5-5.4-DIN(DI)
N$82: LED5-5.2-DOUT(DO) LED5-6.4-DIN(DI)
N$83: LED5-6.2-DOUT(DO) LED5-7.4-DIN(DI)
N$84: LED5-7.2-DOUT(DO) LED5-8.4-DIN(DI)
N$86: LED6-1.2-DOUT(DO) LED6-2.4-DIN(DI)
N$87: LED6-2.2-DOUT(DO) LED6-3.4-DIN(DI)
N$88: LED6-3.2-DOUT(DO) LED6-4.4-DIN(DI)
N$89: LED6-4.2-DOUT(DO) LED6-5.4-DIN(DI)
N$90: LED6-5.2-DOUT(DO) LED6-6.4-DIN(DI)
N$91: LED6-7.2-DOUT(DO) LED6-8.4-DIN(DI)
N$94: LED7-1.2-DOUT(DO) LED7-2.4-DIN(DI)
N$95: LED7-2.2-DOUT(DO) LED7-3.4-DIN(DI)
N$96: LED7-3.2-DOUT(DO) LED7-4.4-DIN(DI)
N$97: LED7-4.2-DOUT(DO) LED7-5.4-DIN(DI)
N$98: LED7-5.2-DOUT(DO) LED7-6.4-DIN(DI)
N$99: LED7-6.2-DOUT(DO) LED7-7.4-DIN(DI)
N$100: LED7-7.2-DOUT(DO) LED7-8.4-DIN(DI)
N$102: LED8-1.2-DOUT(DO) LED8-2.4-DIN(DI)
N$103: LED8-2.2-DOUT(DO) LED8-3.4-DIN(DI)
N$104: LED8-3.2-DOUT(DO) LED8-4.4-DIN(DI)
N$105: LED8-4.2-DOUT(DO) LED8-5.4-DIN(DI)
N$106: LED8-5.2-DOUT(DO) LED8-6.4-DIN(DI)
N$107: LED8-6.2-DOUT(DO) LED8-7.4-DIN(DI)
N$108: LED8-7.2-DOUT(DO) LED8-8.4-DIN(DI)
N$110: LED6-8.2-DOUT(DO) LED7-1.4-DIN(DI)
N$111: LED4-8.2-DOUT(DO) LED5-1.4-DIN(DI)
VIN: C21.+ C23.2 IC5.1(VIN) ; also sheet 1
Unconnected: LED8-8.2-DOUT(DO)

### Notes on the sheet
- LED MATRIX

## Sheet 3 of 3
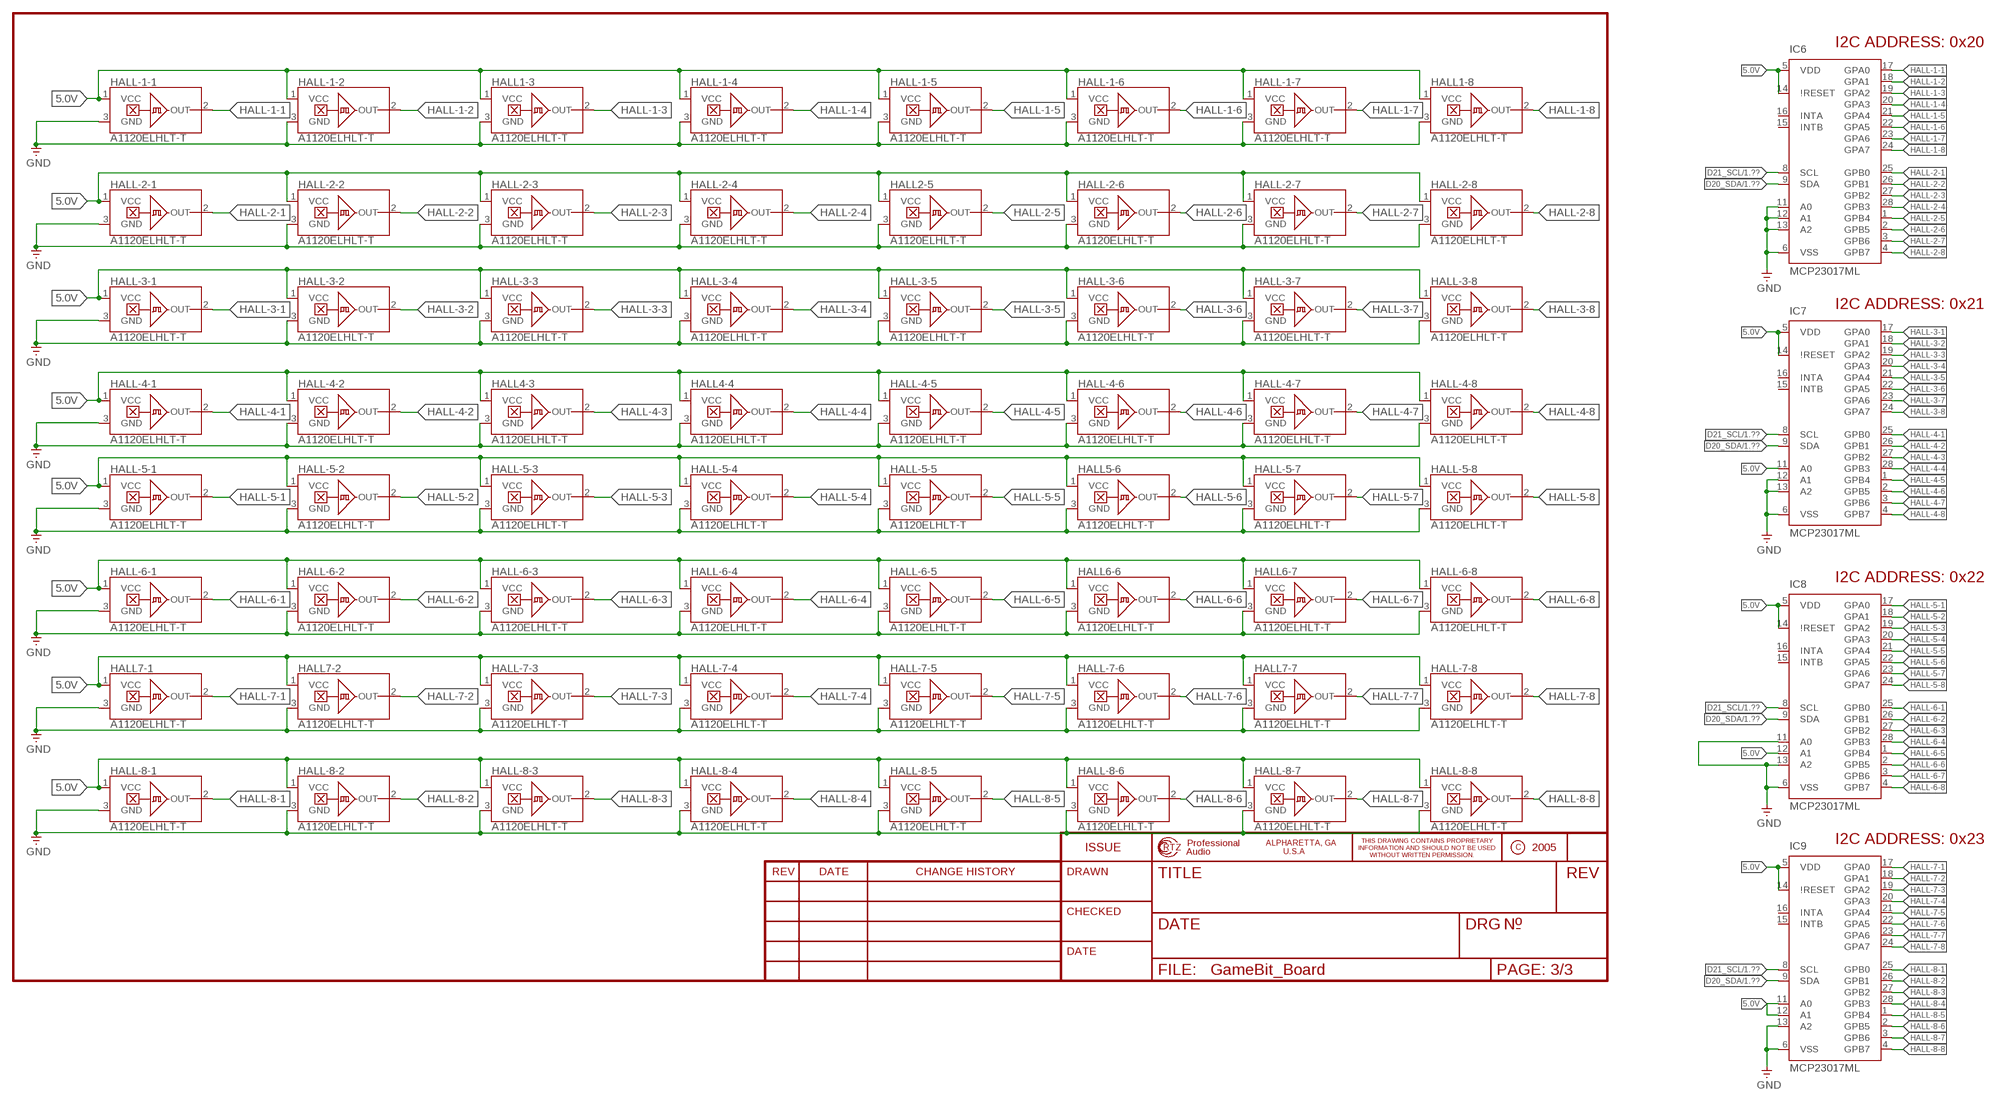
[diagram p2: schematic, sheet 3]

### Parts
HALL1-3  A1120ELHLT-T  [SOT95P290X110-3N]
HALL1-8  A1120ELHLT-T  [SOT95P290X110-3N]
HALL2-5  A1120ELHLT-T  [SOT95P290X110-3N]
HALL4-3  A1120ELHLT-T  [SOT95P290X110-3N]
HALL4-4  A1120ELHLT-T  [SOT95P290X110-3N]
HALL5-6  A1120ELHLT-T  [SOT95P290X110-3N]
HALL6-6  A1120ELHLT-T  [SOT95P290X110-3N]
HALL6-7  A1120ELHLT-T  [SOT95P290X110-3N]
HALL7-1  A1120ELHLT-T  [SOT95P290X110-3N]
HALL7-2  A1120ELHLT-T  [SOT95P290X110-3N]
HALL7-7  A1120ELHLT-T  [SOT95P290X110-3N]
HALL-1-1  A1120ELHLT-T  [SOT95P290X110-3N]
HALL-1-2  A1120ELHLT-T  [SOT95P290X110-3N]
HALL-1-4  A1120ELHLT-T  [SOT95P290X110-3N]
HALL-1-5  A1120ELHLT-T  [SOT95P290X110-3N]
HALL-1-6  A1120ELHLT-T  [SOT95P290X110-3N]
HALL-1-7  A1120ELHLT-T  [SOT95P290X110-3N]
HALL-2-1  A1120ELHLT-T  [SOT95P290X110-3N]
HALL-2-2  A1120ELHLT-T  [SOT95P290X110-3N]
HALL-2-3  A1120ELHLT-T  [SOT95P290X110-3N]
HALL-2-4  A1120ELHLT-T  [SOT95P290X110-3N]
HALL-2-6  A1120ELHLT-T  [SOT95P290X110-3N]
HALL-2-7  A1120ELHLT-T  [SOT95P290X110-3N]
HALL-2-8  A1120ELHLT-T  [SOT95P290X110-3N]
HALL-3-1  A1120ELHLT-T  [SOT95P290X110-3N]
HALL-3-2  A1120ELHLT-T  [SOT95P290X110-3N]
HALL-3-3  A1120ELHLT-T  [SOT95P290X110-3N]
HALL-3-4  A1120ELHLT-T  [SOT95P290X110-3N]
HALL-3-5  A1120ELHLT-T  [SOT95P290X110-3N]
HALL-3-6  A1120ELHLT-T  [SOT95P290X110-3N]
HALL-3-7  A1120ELHLT-T  [SOT95P290X110-3N]
HALL-3-8  A1120ELHLT-T  [SOT95P290X110-3N]
HALL-4-1  A1120ELHLT-T  [SOT95P290X110-3N]
HALL-4-2  A1120ELHLT-T  [SOT95P290X110-3N]
HALL-4-5  A1120ELHLT-T  [SOT95P290X110-3N]
HALL-4-6  A1120ELHLT-T  [SOT95P290X110-3N]
HALL-4-7  A1120ELHLT-T  [SOT95P290X110-3N]
HALL-4-8  A1120ELHLT-T  [SOT95P290X110-3N]
HALL-5-1  A1120ELHLT-T  [SOT95P290X110-3N]
HALL-5-2  A1120ELHLT-T  [SOT95P290X110-3N]
HALL-5-3  A1120ELHLT-T  [SOT95P290X110-3N]
HALL-5-4  A1120ELHLT-T  [SOT95P290X110-3N]
HALL-5-5  A1120ELHLT-T  [SOT95P290X110-3N]
HALL-5-7  A1120ELHLT-T  [SOT95P290X110-3N]
HALL-5-8  A1120ELHLT-T  [SOT95P290X110-3N]
HALL-6-1  A1120ELHLT-T  [SOT95P290X110-3N]
HALL-6-2  A1120ELHLT-T  [SOT95P290X110-3N]
HALL-6-3  A1120ELHLT-T  [SOT95P290X110-3N]
HALL-6-4  A1120ELHLT-T  [SOT95P290X110-3N]
HALL-6-5  A1120ELHLT-T  [SOT95P290X110-3N]
HALL-6-8  A1120ELHLT-T  [SOT95P290X110-3N]
HALL-7-3  A1120ELHLT-T  [SOT95P290X110-3N]
HALL-7-4  A1120ELHLT-T  [SOT95P290X110-3N]
HALL-7-5  A1120ELHLT-T  [SOT95P290X110-3N]
HALL-7-6  A1120ELHLT-T  [SOT95P290X110-3N]
HALL-7-8  A1120ELHLT-T  [SOT95P290X110-3N]
HALL-8-1  A1120ELHLT-T  [SOT95P290X110-3N]
HALL-8-2  A1120ELHLT-T  [SOT95P290X110-3N]
HALL-8-3  A1120ELHLT-T  [SOT95P290X110-3N]
HALL-8-4  A1120ELHLT-T  [SOT95P290X110-3N]
HALL-8-5  A1120ELHLT-T  [SOT95P290X110-3N]
HALL-8-6  A1120ELHLT-T  [SOT95P290X110-3N]
HALL-8-7  A1120ELHLT-T  [SOT95P290X110-3N]
HALL-8-8  A1120ELHLT-T  [SOT95P290X110-3N]
IC6  MCP23017ML  [QFN28-ML_6X6MM]
IC7  MCP23017ML  [QFN28-ML_6X6MM]
IC8  MCP23017ML  [QFN28-ML_6X6MM]
IC9  MCP23017ML  [QFN28-ML_6X6MM]

### Nets
5.0V: HALL1-3.1(VCC) HALL1-8.1(VCC) HALL2-5.1(VCC) HALL4-3.1(VCC) HALL4-4.1(VCC) HALL5-6.1(VCC) HALL6-6.1(VCC) HALL6-7.1(VCC) HALL7-1.1(VCC) HALL7-2.1(VCC) HALL7-7.1(VCC) HALL-1-1.1(VCC) HALL-1-2.1(VCC) HALL-1-4.1(VCC) HALL-1-5.1(VCC) HALL-1-6.1(VCC) HALL-1-7.1(VCC) HALL-2-1.1(VCC) HALL-2-2.1(VCC) HALL-2-3.1(VCC) HALL-2-4.1(VCC) HALL-2-6.1(VCC) HALL-2-7.1(VCC) HALL-2-8.1(VCC) HALL-3-1.1(VCC) HALL-3-2.1(VCC) HALL-3-3.1(VCC) HALL-3-4.1(VCC) HALL-3-5.1(VCC) HALL-3-6.1(VCC) HALL-3-7.1(VCC) HALL-3-8.1(VCC) HALL-4-1.1(VCC) HALL-4-2.1(VCC) HALL-4-5.1(VCC) HALL-4-6.1(VCC) HALL-4-7.1(VCC) HALL-4-8.1(VCC) HALL-5-1.1(VCC) HALL-5-2.1(VCC) HALL-5-3.1(VCC) HALL-5-4.1(VCC) HALL-5-5.1(VCC) HALL-5-7.1(VCC) HALL-5-8.1(VCC) HALL-6-1.1(VCC) HALL-6-2.1(VCC) HALL-6-3.1(VCC) HALL-6-4.1(VCC) HALL-6-5.1(VCC) HALL-6-8.1(VCC) HALL-7-3.1(VCC) HALL-7-4.1(VCC) HALL-7-5.1(VCC) HALL-7-6.1(VCC) HALL-7-8.1(VCC) HALL-8-1.1(VCC) HALL-8-2.1(VCC) HALL-8-3.1(VCC) HALL-8-4.1(VCC) HALL-8-5.1(VCC) HALL-8-6.1(VCC) HALL-8-7.1(VCC) HALL-8-8.1(VCC) IC6.5(VDD) IC6.14(\!RESET) IC7.5(VDD) IC7.11(A0) IC7.14(\!RESET) IC8.5(VDD) IC8.12(A1) IC8.14(\!RESET) IC9.5(VDD) IC9.11(A0) IC9.12(A1) IC9.14(\!RESET) ; also sheet 1
D20_SDA: IC6.9(SDA) IC7.9(SDA) IC8.9(SDA) IC9.9(SDA) ; also sheet 1
D21_SCL: IC6.8(SCL) IC7.8(SCL) IC8.8(SCL) IC9.8(SCL) ; also sheet 1
GND: HALL1-3.3(GND) HALL1-8.3(GND) HALL2-5.3(GND) HALL4-3.3(GND) HALL4-4.3(GND) HALL5-6.3(GND) HALL6-6.3(GND) HALL6-7.3(GND) HALL7-1.3(GND) HALL7-2.3(GND) HALL7-7.3(GND) HALL-1-1.3(GND) HALL-1-2.3(GND) HALL-1-4.3(GND) HALL-1-5.3(GND) HALL-1-6.3(GND) HALL-1-7.3(GND) HALL-2-1.3(GND) HALL-2-2.3(GND) HALL-2-3.3(GND) HALL-2-4.3(GND) HALL-2-6.3(GND) HALL-2-7.3(GND) HALL-2-8.3(GND) HALL-3-1.3(GND) HALL-3-2.3(GND) HALL-3-3.3(GND) HALL-3-4.3(GND) HALL-3-5.3(GND) HALL-3-6.3(GND) HALL-3-7.3(GND) HALL-3-8.3(GND) HALL-4-1.3(GND) HALL-4-2.3(GND) HALL-4-5.3(GND) HALL-4-6.3(GND) HALL-4-7.3(GND) HALL-4-8.3(GND) HALL-5-1.3(GND) HALL-5-2.3(GND) HALL-5-3.3(GND) HALL-5-4.3(GND) HALL-5-5.3(GND) HALL-5-7.3(GND) HALL-5-8.3(GND) HALL-6-1.3(GND) HALL-6-2.3(GND) HALL-6-3.3(GND) HALL-6-4.3(GND) HALL-6-5.3(GND) HALL-6-8.3(GND) HALL-7-3.3(GND) HALL-7-4.3(GND) HALL-7-5.3(GND) HALL-7-6.3(GND) HALL-7-8.3(GND) HALL-8-1.3(GND) HALL-8-2.3(GND) HALL-8-3.3(GND) HALL-8-4.3(GND) HALL-8-5.3(GND) HALL-8-6.3(GND) HALL-8-7.3(GND) HALL-8-8.3(GND) IC6.6(VSS) IC6.11(A0) IC6.12(A1) IC6.13(A2) IC7.6(VSS) IC7.12(A1) IC7.13(A2) IC8.6(VSS) IC8.11(A0) IC8.13(A2) IC9.6(VSS) IC9.13(A2) ; also sheet 1,2
HALL-1-1: HALL-1-1.2(OUT) IC6.17(GPA0)
HALL-1-2: HALL-1-2.2(OUT) IC6.18(GPA1)
HALL-1-3: HALL1-3.2(OUT) IC6.19(GPA2)
HALL-1-4: HALL-1-4.2(OUT) IC6.20(GPA3)
HALL-1-5: HALL-1-5.2(OUT) IC6.21(GPA4)
HALL-1-6: HALL-1-6.2(OUT) IC6.22(GPA5)
HALL-1-7: HALL-1-7.2(OUT) IC6.23(GPA6)
HALL-1-8: HALL1-8.2(OUT) IC6.24(GPA7)
HALL-2-1: HALL-2-1.2(OUT) IC6.25(GPB0)
HALL-2-2: HALL-2-2.2(OUT) IC6.26(GPB1)
HALL-2-3: HALL-2-3.2(OUT) IC6.27(GPB2)
HALL-2-4: HALL-2-4.2(OUT) IC6.28(GPB3)
HALL-2-5: HALL2-5.2(OUT) IC6.1(GPB4)
HALL-2-6: HALL-2-6.2(OUT) IC6.2(GPB5)
HALL-2-7: HALL-2-7.2(OUT) IC6.3(GPB6)
HALL-2-8: HALL-2-8.2(OUT) IC6.4(GPB7)
HALL-3-1: HALL-3-1.2(OUT) IC7.17(GPA0)
HALL-3-2: HALL-3-2.2(OUT) IC7.18(GPA1)
HALL-3-3: HALL-3-3.2(OUT) IC7.19(GPA2)
HALL-3-4: HALL-3-4.2(OUT) IC7.20(GPA3)
HALL-3-5: HALL-3-5.2(OUT) IC7.21(GPA4)
HALL-3-6: HALL-3-6.2(OUT) IC7.22(GPA5)
HALL-3-7: HALL-3-7.2(OUT) IC7.23(GPA6)
HALL-3-8: HALL-3-8.2(OUT) IC7.24(GPA7)
HALL-4-1: HALL-4-1.2(OUT) IC7.25(GPB0)
HALL-4-2: HALL-4-2.2(OUT) IC7.26(GPB1)
HALL-4-3: HALL4-3.2(OUT) IC7.27(GPB2)
HALL-4-4: HALL4-4.2(OUT) IC7.28(GPB3)
HALL-4-5: HALL-4-5.2(OUT) IC7.1(GPB4)
HALL-4-6: HALL-4-6.2(OUT) IC7.2(GPB5)
HALL-4-7: HALL-4-7.2(OUT) IC7.3(GPB6)
HALL-4-8: HALL-4-8.2(OUT) IC7.4(GPB7)
HALL-5-1: HALL-5-1.2(OUT) IC8.17(GPA0)
HALL-5-2: HALL-5-2.2(OUT) IC8.18(GPA1)
HALL-5-3: HALL-5-3.2(OUT) IC8.19(GPA2)
HALL-5-4: HALL-5-4.2(OUT) IC8.20(GPA3)
HALL-5-5: HALL-5-5.2(OUT) IC8.21(GPA4)
HALL-5-6: HALL5-6.2(OUT) IC8.22(GPA5)
HALL-5-7: HALL-5-7.2(OUT) IC8.23(GPA6)
HALL-5-8: HALL-5-8.2(OUT) IC8.24(GPA7)
HALL-6-1: HALL-6-1.2(OUT) IC8.25(GPB0)
HALL-6-2: HALL-6-2.2(OUT) IC8.26(GPB1)
HALL-6-3: HALL-6-3.2(OUT) IC8.27(GPB2)
HALL-6-4: HALL-6-4.2(OUT) IC8.28(GPB3)
HALL-6-5: HALL-6-5.2(OUT) IC8.1(GPB4)
HALL-6-6: HALL6-6.2(OUT) IC8.2(GPB5)
HALL-6-7: HALL6-7.2(OUT) IC8.3(GPB6)
HALL-6-8: HALL-6-8.2(OUT) IC8.4(GPB7)
HALL-7-1: HALL7-1.2(OUT) IC9.17(GPA0)
HALL-7-2: HALL7-2.2(OUT) IC9.18(GPA1)
HALL-7-3: HALL-7-3.2(OUT) IC9.19(GPA2)
HALL-7-4: HALL-7-4.2(OUT) IC9.20(GPA3)
HALL-7-5: HALL-7-5.2(OUT) IC9.21(GPA4)
HALL-7-6: HALL-7-6.2(OUT) IC9.22(GPA5)
HALL-7-7: HALL7-7.2(OUT) IC9.23(GPA6)
HALL-7-8: HALL-7-8.2(OUT) IC9.24(GPA7)
HALL-8-1: HALL-8-1.2(OUT) IC9.25(GPB0)
HALL-8-2: HALL-8-2.2(OUT) IC9.26(GPB1)
HALL-8-3: HALL-8-3.2(OUT) IC9.27(GPB2)
HALL-8-4: HALL-8-4.2(OUT) IC9.28(GPB3)
HALL-8-5: HALL-8-5.2(OUT) IC9.1(GPB4)
HALL-8-6: HALL-8-6.2(OUT) IC9.2(GPB5)
HALL-8-7: HALL-8-7.2(OUT) IC9.3(GPB6)
HALL-8-8: HALL-8-8.2(OUT) IC9.4(GPB7)
Unconnected: IC6.15(INTB) IC6.16(INTA) IC7.15(INTB) IC7.16(INTA) IC8.15(INTB) IC8.16(INTA) IC9.15(INTB) IC9.16(INTA)

### Notes on the sheet
- I2C ADDRESS: 0x20
- I2C ADDRESS: 0x21
- I2C ADDRESS: 0x22
- I2C ADDRESS: 0x23

## Library data of the parts
C1-C4 C7 C8 C10 = microbuilder:CAP_CERAMIC: Ceramic Capacitors 0402 - 0402 Surface Mount Capacitors 16pF 50V 5% [Digikey: 445-4899-2-ND] 18pF 50V 5% [Digikey: 490-1281-2-ND] 22pF 50V 5% [Digikey: 490-1283-2-ND] 68pF 50V 5% [Digikey: 490-1289-2-ND] 0.1uF 10V 10% [Digikey: 490-1318-2-ND] 1.0uF 6.3V 10% [Digikey: 490-1320-2-ND] 0603 - 0603 Surface Mount Capacitors 16 pF 50V 5% [Digikey: 445-5051-2-ND] 22 pF 50V [Digikey: PCC220ACVTR-ND] 33 pF 50V 5% [Digikey: 490-1415-1-ND] 56pF 50V 5% [Digikey: 490-1421-1-ND] 220pF 50V 5% [Digikey: 445-1285-1-ND] 680 pF 50V 2200 pF 50V 5% C0G [Digikey: 445-1297-1-ND] 5600 pF 100V 5% X7R [Digikey: 478-3711-1-ND] 0.1 µF 25V 10% [Digikey: PCC2277TR-ND] 0.22 µF 16V 10% X7R [Digikey: 445-1318-1-ND] 1.0 µF 25V 10% [Digikey: 445-5146-2-ND] 0603 - RF Specific 3pF 250V +/-0.1pF RF [Digikey: 712-1347-1-ND] 18 pF 250V 5% [Digikey: 478-3505-1-ND or 712-1322-1-ND] 56 pF 250V 5% C0G RF [Digikey: 490-4867-1-ND] 68 pF 250V RF [Digikey: 490-4868-1-ND] 0805 - 0805 Surface Mount Capacitors 220 pF 250V 2% RF Ceramic Capacitor [Digikey: 712-1398-1-ND] 1000 pF 50V 2% NP0 Ceramic Capacitor [Digikey: 478-3760-1-ND] 0.1 µF 25V 10% Ceramic Capacitor [Digikey: PCC1828TR-ND] 1.0 µF 16V 10% Ceramic Capacitor[Digikey: 490-1691-2-ND] 10.0 µF 10V 10% Ceramic Capacitor[Digikey: 709-1228-1-ND] 10.0 uF 16V 10% Ceramic Capacitor [Digikey: 478-5165-2-ND] 47 uF 6.3V 20% Ceramic Capacitor [Digikey: 587-1779-1-ND or 399-5506-1-ND] 1206 - 1206 Surface Mount Capacitors 47uF 10V 20% Ceramic Capacitor [Digikey: 490-5528-1-ND or 399-5508-1-ND or 445-6010-1-ND]
C1-1-C1-8 C2-1-C2-8 C3-1-C3-8 C4-1-C4-8 C5-1-C5-8 C6-1-C6-8 C7-1-C7-8 C8-1-C8-3 C8-4\ C8-5-C8-8 C15 C16 C19 C20 C23 C24 = cap-master:CNP-: NON-POLARIZED CAP
C5 C6 = rcl:CPOL-US: POLARIZED CAPACITOR, American symbol; SPICEPREFIX: C
C13 C14 C17 C18 C21 C22 = microbuilder:CAP_ELECTROLYTIC: Electrolytic Capacitors PANASONIC_C - Size C Panasonic Electrolytic Aluminum Capacitor 47µF 16V 20% Electrolytic Capacitor [Digikey: PCE3890TR-ND] PANASONIC_D - Size D Panasonic Electrolytic Aluminum Capacitor 100µF 25V 20% Electrolytic Capacitor [Digikey: PCE3898TR-ND]
C31 = adafruit:C-US: CAPACITOR, American symbol
CN1 = adafruit:DCBARREL: 2.0mm DC Barrel Jack DCJACK_2MM_PTH - Through Hole Jack (4UConnector: 05537)
D1 D2 = microbuilder:DIODE: Diode SMADIODE - SMA Surface Mount Package 20V 1A Schottky Diode Digikey (500mV @ 1A, 500uA Vr @ 20V): 641-1014-6-ND 10V 2A Schottky Diode Digikey (350mV @ 2A, 700uA Vr @ 10V): MBRA210LT3 SOD-123 30V 200mA (800mV Vf, 2uA Vr @ 25V) Schottky Diode (very fast switching for boost, etc.) - Digikey: BAT54T1GOSTR-ND 30V 500mA (430mV Vf, 130uA Vr @ 30V) Schottky Diode - Digikey: B0530W-FDICT-ND MBR120 1A 20V (0.34Vf) Schottky Diode - Digikey: MBR120VLSFT1GOSCT-ND SOD-323 10V 570mA (380mV Vf, 3ns) Schottky Diode - Digikey: ZLLS410CT-ND 1N4148WS - 75V 150mA (1V Vf @ 10mA, 4ns) Simple Diode - Digikey: 1N4148WSFSCT-ND, Mouser: 512-1N4148WS SOD-523 BAT54 30V 200mA Schottky (0.8 Vf @ 100mA, 5ns) - Digikey: BAT54XV2CT-ND 30V 30mA Schottky Diode (RB751S-40TE61) - Digikey: RB751S-40TE61CT-ND SOT23-R/W - SOT23 Package (R = Solder Paste/Reflow Ovens, W = Hand-Soldering) BAT54Film 40V 300mA - Digikey: 497-7162-1-ND DO-1N4148 Through Hole Small Current Diode (any model)
D3-D5 = s3x_10:S3*: S3A - S3N General Purpose Rectifiers Source: http://www.fairchildsemi.com/datasheets/S3/S3A.pdf; MF: Fairchild; MPN: S3G; OC_FARNELL: 2454094; OC_NEWARK: 58K2397
F1 = fuse:SHK20L: FUSE HOLDER 5 x 20 mm, SH contact, SHH1 Schukat, E1073 Buerklin; OC_FARNELL: unknown; OC_NEWARK: unknown
HALL1-3 HALL1-8 HALL2-5 HALL4-3 HALL4-4 HALL5-6 HALL6-6 HALL6-7 HALL7-1 HALL7-2 HALL7-7 HALL-1-1 HALL-1-2 HALL-1-4-HALL-1-7 HALL-2-1-HALL-2-4 HALL-2-6-HALL-2-8 HALL-3-1-HALL-3-8 HALL-4-1 HALL-4-2 HALL-4-5-HALL-4-8 HALL-5-1-HALL-5-5 HALL-5-7 HALL-5-8 HALL-6-1-HALL-6-5 HALL-6-8 HALL-7-3-HALL-7-6 HALL-7-8 HALL-8-1-HALL-8-8 = SOT95P290X110-3N:A1120ELHLT-T
IC1 = atmel-2005:ATMEGA*: MICROCONTROLLER 64/128/256 Kbytes FLASH 4 Kbytes EEPROM 8 Kbytes SRAM 86 General Purpose I/O pins 12-channels16-bit PWM 4 x Serial USARTs 16-channels 10-bit A/D
IC2 IC4 IC5 = national-semiconductor:LM2596: SIMPLE SWITCHER® Power Converter 150 kHz 3A Step-Down Voltage Regulator Source: http://www.national.com/ds/LM/LM2596.pdf; MF: NATIONAL SEMICONDUCTOR; MPN: LM2596S-ADJ/NOPB; OC_FARNELL: 9494367; OC_NEWARK: 41K3842
IC3 = adafruit:78*: Positive VOLTAGE REGULATOR Added bigger pads to the TO-92 package
IC6-IC9 = microchip-update-2:MCP23017: http://ww1.microchip.com/downloads/en/DeviceDoc/21952a.pdf Source: http://ww1.microchip.com/downloads/en/DeviceDoc/21952a.pdf
ICSP = SparkFun-Connectors:CONN_03X2: Multi connection point. Often used as Generic Header-pin footprint for 0.1 inch spaced/style header connections You can populate with any combo of single row headers, but if you'd like an exact match, check these: Header - 2x3 (Male, 0.1") <https://www.sparkfun.com/products/12807> (PRT-12807) Header - 2x3 (Female, 0.1") <https://www.sparkfun.com/products/13010> (PRT-13010) 2x3 Pin Shrouded Header <https://www.sparkfun.com/products/10877> (PRT-10877) On any of the 0.1 inch spaced packages, you can populate with these: Break Away Headers - Straight <https://www.sparkfun.com/products/116> (PRT-00116) Break Away Male Headers - Right Angle <https://www.sparkfun.com/products/553> (PRT-00553) Female Headers <https://www.sparkfun.com/products/115> (PRT-00115) Break Away Headers - Machine Pin <https://www.sparkfun.com/products/117> (PRT-00117) Break Away Female Headers - Swiss Machine Pin <https://www.sparkfun.com/products/743> (PRT-00743) Special note: the shrouded connector mates well with our 3x2 ribbon cables: Ribbon Crimp Connector - 6-pin (2x3, Female) <https://www.sparkfun.com/products/10651> (PRT-10651) Ribbon Cable - 6 wire (15ft) <https://www.sparkfun.com/products/10646> (PRT-10646); PROD_ID: CONN-11566
J1 J2 = SparkFun-Connectors:CONN_04: Multi connection point. Often used as Generic Header-pin footprint for 0.1 inch spaced/style header connections On any of the 0.1 inch spaced packages, you can populate with these: Break Away Headers - Straight <https://www.sparkfun.com/products/116> (PRT-00116) Break Away Male Headers - Right Angle <https://www.sparkfun.com/products/553> (PRT-00553) Female Headers <https://www.sparkfun.com/products/115> (PRT-00115) Break Away Headers - Machine Pin <https://www.sparkfun.com/products/117> (PRT-00117) Break Away Female Headers - Swiss Machine Pin <https://www.sparkfun.com/products/743> (PRT-00743) For SCREWTERMINALS and SPRING TERMINALS visit here: Screw Terimnals on SparkFun.com <https://www.sparkfun.com/search/results?term=Screw+Terminals> (5mm/3.5mm/2.54mm spacing) This device is also useful as a general connection point to wire up your design to another part of your project. Our various solder wires solder well into these plated through hole pads. Hook-Up Wire - Assortment (Stranded, 22 AWG) <https://www.sparkfun.com/products/11375> (PRT-11375) Hook-Up Wire - Assortment (Solid Core, 22 AWG) <https://www.sparkfun.com/products/11367> (PRT-11367) View the entire wire category on our website here <https://www.sparkfun.com/categories/141> Special notes: Molex polarized connector foot print use with SKU : PRT-08231 with associated crimp pins and housings. 1MM SMD Version SKU: PRT-10208; PROD_ID: CONN-13251
J3 = SparkFun-Connectors:USB_B: USB Type B Connector SparkFun Products: SparkFun Stepoko <https://www.sparkfun.com/products/13899> PTH; PROD_ID: CONN-08278; SF_ID: PRT-00139
L1-L3 = inductor-bourns:SRR1280: POWER INDUCTOR
LED1-LED4 = microbuilder:LED: LED 0603 - 0603 Surface Mount Package 2mA: Green LED - Low Power (3.9mcd, 2ma, 1.7Vf) - Digikey: 475-2709-2-ND Orange LED - Low Power (9.8mcd, 2ma, 1.8Vf) - Digikey: 475-1194-2-ND Red LED - Low Power (5mcd, 2ma, 1.8Vf) - Digikey: 475-1195-2-ND Yellow LED - Low Power (7mcd, 2ma, 1.8Vf) - Digikey: 475-1196-2-ND 5mA: Blue LED - Low Power (17mcd, 5ma, 2.9Vf) - Digikey: LNJ937W8CRACT-ND 0805 - 0805 Surface Mount Package 2mA: Red LED (8.8mcd, 2mA, 1.8Vf, Clear) - Low Power [Digikey: 475-2510-1-ND] Green LED (5mcd, 2mA, 1.8Vf, Clear) - Low Power [Digikey: 475-2730-1-ND] Yellow LED (11.3mcd, 2mA, 1.8Vf, Clear) - Low Power [Digikey: 475-2555-1-ND] 20mA: Red LED (104mcd, 20mA, Diffused) - LS R976 [Digikey: 475-1278-6-ND] Red LED (12mcd, 20mA, 2.0Vf, Clear) - APT2012EC [Digikey: 754-1128-1-ND] Green LED (15mcd, 20mA, 2.2Vf, Clear) - APT2012GC [Digikey: 754-1131-1-ND] Orange LED (160mcd, 20mA, 2.1Vf, Clear) - APT2012SECK [Digikey: 754-1130-1-ND] 1206 - 1206 Surface Mount Package Green LED (26mcd, 20mA, Diffused) - LG N971 [Digikey: 475-1407-6-ND] Red LED (15mcd, 20mA, Diffused) - LH N974 [Digikey: 475-1416-6-ND]
LED1-1-LED1-8 LED2-1-LED2-8 LED3-1-LED3-8 LED4-1-LED4-8 LED5-1-LED5-8 LED6-1-LED6-8 LED7-1-LED7-8 LED8-1-LED8-8 = adafruit:WS2812B
R1 R10 R13 = pot:TRIM_US-: POTENTIOMETER
R2 R11 R12 R14 = adafruit:R-US_: RESISTOR, American symbol
R3-R9 R15 R16 = microbuilder:RESISTOR: Resistors 0402 - 0402 Surface Mount Package 22 Ohm 1% 1/16W [Digikey: 311-22.0LRTR-ND] 33 Ohm 5% 1/16W 1.0K 5% 1/16W 1.5K 5% 1/16W 2.0K 1% 1/16W 10.0K 1% 1/16W [Digikey: 311-10.0KLRTR-ND] 10.0K 5% 1/16W [Digikey: RMCF0402JT10K0TR-ND] 12.1K 1% 1/16W [Digikey: 311-22.0LRTR-ND] 100.0K 5% 1/16W 0603 - 0603 Surface Mount Package 0 Ohm 1/10 Watt 1% Resistor 15 Ohm 1/10 Watt 1% Resistor 33 Ohm 1/10 Watt 1% Resistor 49.9 Ohm 1/10 Watt 1% Resistor 100 Ohm 1/10 Watt 1% Resistor 150 Ohm 1/10 Watt 1% Resistor 240 Ohm 1/10 Watt 1% Resistor 390 Ohm 1/10 Watt 1% Resistor 560 Ohm 1/10 Watt 1% Resistor 680 Ohm 1/10 Watt 1% Resistor 750 Ohm 1/10 Watt 1% Resistor 1.0K Ohm 1/10 Watt 1% Resistor 1.5K Ohm 1/10 Watt 1% Resistor 2.0K Ohm 1/10 Watt 1% Resistor 2.2K Ohm 1/10 Watt 1% Resistor 3.3K Ohm 1/10 Watt 1% Resistor 4.7K Ohm 1/10 Watt 1% Resistor 10.0K Ohm 1/10 Watt 1% Resistor 12.0K Ohm 1/10 Watt 1% Resistor 12.1K Ohm 1/10 Watt 1% Resistor 20.0K Ohm 1/10 Watt 1% Resistor 33.0K Ohm 1/10 Watt 1% Resistor 100.0K Ohm 1/10 Watt 1% Resistor 0805 - 0805 Surface Mount Package 0 Ohm 1/8 Watt 1% Resistor 33 Ohm 1/8 Watt 1% Resistor 100 Ohm 1/8 Watt 1% Resistor 150 Ohm 1/8 Watt 1% Resistor 200 Ohm 1/8 Watt 1% Resistor 240 Ohm 1/8 Watt 1% Resistor 330 Ohm 1/8 Watt 1% Resistor 390 Ohm 1/8 Watt 1% Resistor 470 Ohm 1/8 Watt 1% Resistor 1.0K Ohm 1/8 Watt 1% Resistor 1.5K Ohm 1/8 Watt 1% Resistor 2.0K Ohm 1/8 Watt 1% Resistor 4.7K Ohm 1/8 Watt 1% Resistor 5.1K Ohm 1/8 Watt 1% Resistor 5.6K Ohm 1/8 Watt 1% Resistor 10.0K Ohm 1/8 Watt 1% Resistor 22.0K Ohm 1/8 Watt 1% Resistor 33.0K Ohm 1/8 Watt 1% Resistor 100K Ohm 1/8 Watt 1% Resistor 1206 - 1206 Surface Mount Package 2012 - 2010 Surface Mount Package 0.11 Ohm 1/2 Watt 1% Resistor - Digikey: RHM.11UCT-ND
S1 = switch-tact:DTSM-6
STEPDRV1 STEPDRV2 = stepper_drivers_etc:POLOLULU2128
U1 = microbuilder:FT232RL: FTDI FT232RL USB TO RS232 Converter Digikey: 768-1007-1-ND
U$50 = SparkFun:RESONATOR: Resonator Small SMD resonator. This is the itty bitty 10/20MHz resonators with built in caps. CSTCE10M0G55 and CSTCE20M0V53. Footprint has been reviewed closely but hasn't been tested yet.